# EAGLE design eggplant (EAGLE 7.7.0)
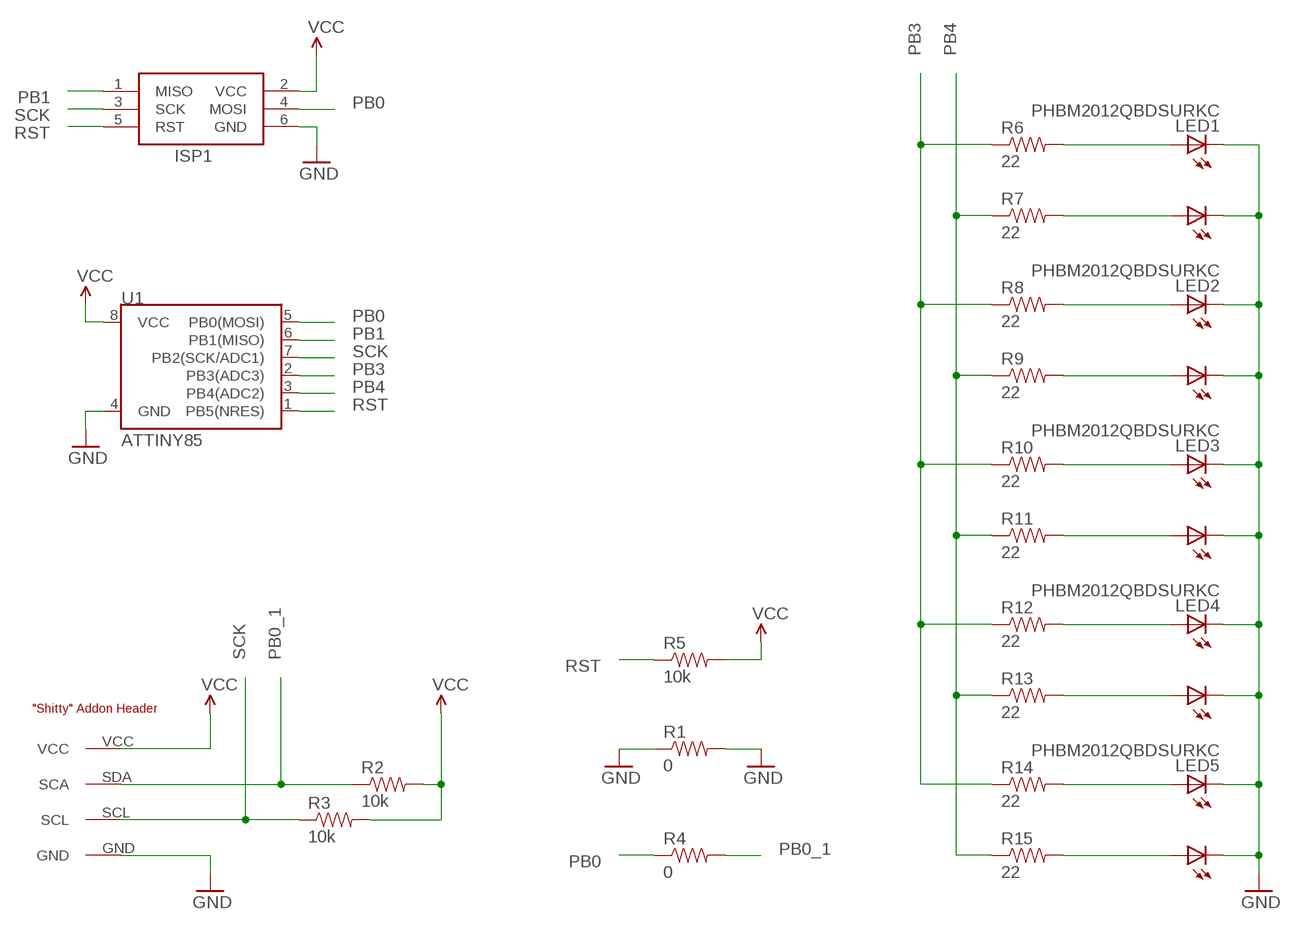
[diagram p0: schematic, sheet 1]

## Parts
ISP1  AVRISPPOGO  [AVRISP-POGO]
LED1  PHBM2012QBDSURKC  DUAL_LED0805  [0805-DUALLED]
LED2  PHBM2012QBDSURKC  DUAL_LED0805  [0805-DUALLED]
LED3  PHBM2012QBDSURKC  DUAL_LED0805  [0805-DUALLED]
LED4  PHBM2012QBDSURKC  DUAL_LED0805  [0805-DUALLED]
LED5  PHBM2012QBDSURKC  DUAL_LED0805  [0805-DUALLED]
R1  0  RESISTOR0805-RES  [0805]
R2  10k  RESISTOR0603-RES  [0603-RES]
R3  10k  RESISTOR0603-RES  [0603-RES]
R4  0  RESISTOR0805-RES  [0805]
R5  10k  RESISTOR0603-RES  [0603-RES]
R6  22  RESISTOR0603-RES  [0603-RES]
R7  22  RESISTOR0603-RES  [0603-RES]
R8  22  RESISTOR0603-RES  [0603-RES]
R9  22  RESISTOR0603-RES  [0603-RES]
R10  22  RESISTOR0603-RES  [0603-RES]
R11  22  RESISTOR0603-RES  [0603-RES]
R12  22  RESISTOR0603-RES  [0603-RES]
R13  22  RESISTOR0603-RES  [0603-RES]
R14  22  RESISTOR0603-RES  [0603-RES]
R15  22  RESISTOR0603-RES  [0603-RES]
U1  ATTINY85  ATTINY45  [SO08-EIAJ]
U$1  ADDONSC_ADDON_SMD  [SC_ADDON_SMD]

## Nets
GND: ISP1.6(GND) LED1.CB(C1) LED1.CR(C2) LED2.CB(C1) LED2.CR(C2) LED3.CB(C1) LED3.CR(C2) LED4.CB(C1) LED4.CR(C2) LED5.CB(C1) LED5.CR(C2) R1.1 R1.2 U1.4(GND) U$1.GND
N$1: LED1.AB(A1) R6.2
N$4: LED1.AR(A2) R7.2
N$5: LED2.AB(A1) R8.2
N$6: LED2.AR(A2) R9.2
N$7: LED3.AB(A1) R10.2
N$8: LED3.AR(A2) R11.2
N$9: LED4.AB(A1) R12.2
N$10: LED4.AR(A2) R13.2
N$11: LED5.AB(A1) R14.2
N$12: LED5.AR(A2) R15.2
PB0: ISP1.4(MOSI) R4.1 U1.5(PB0(MOSI))
PB0_1: R2.1 R4.2 U$1.SDA(SCA)
PB1: ISP1.1(MISO) U1.6(PB1(MISO))
PB3: R6.1 R8.1 R10.1 R12.1 R14.1 U1.2(PB3(ADC3))
PB4: R7.1 R9.1 R11.1 R13.1 R15.1 U1.3(PB4(ADC2))
RST: ISP1.5(RST) R5.1 U1.1(PB5(NRES))
SCK: ISP1.3(SCK) R3.1 U1.7(PB2(SCK/ADC1)) U$1.SCL
VCC: ISP1.2(VCC) R2.2 R3.2 R5.2 U1.8(VCC) U$1.VCC

## Library data of the parts
ISP1 = darknet_parts_library:AVRISP: AVR ISP HEADER Standard 6 pin header for AVR programming
LED1-LED5 = darknet_parts_library:DUAL_LED
R1-R15 = SYNShop:RESISTOR: Resistor Basic schematic elements and footprints for 0603, 1206, and PTH resistors.
U1 = SparkFun:ATTINY45: Atmel ATTiny45
U$1 = darknet_parts_library:ADDON

## Board
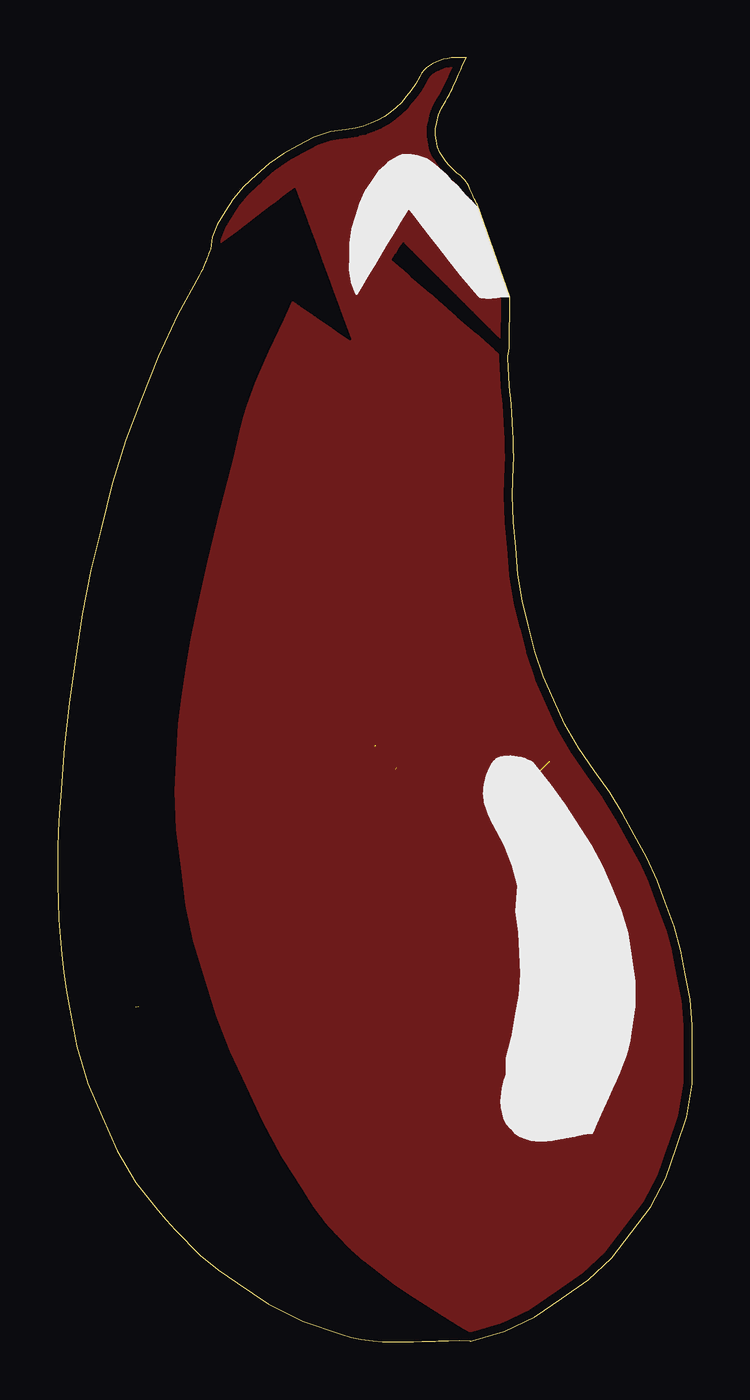
[diagram p1: board, top side]
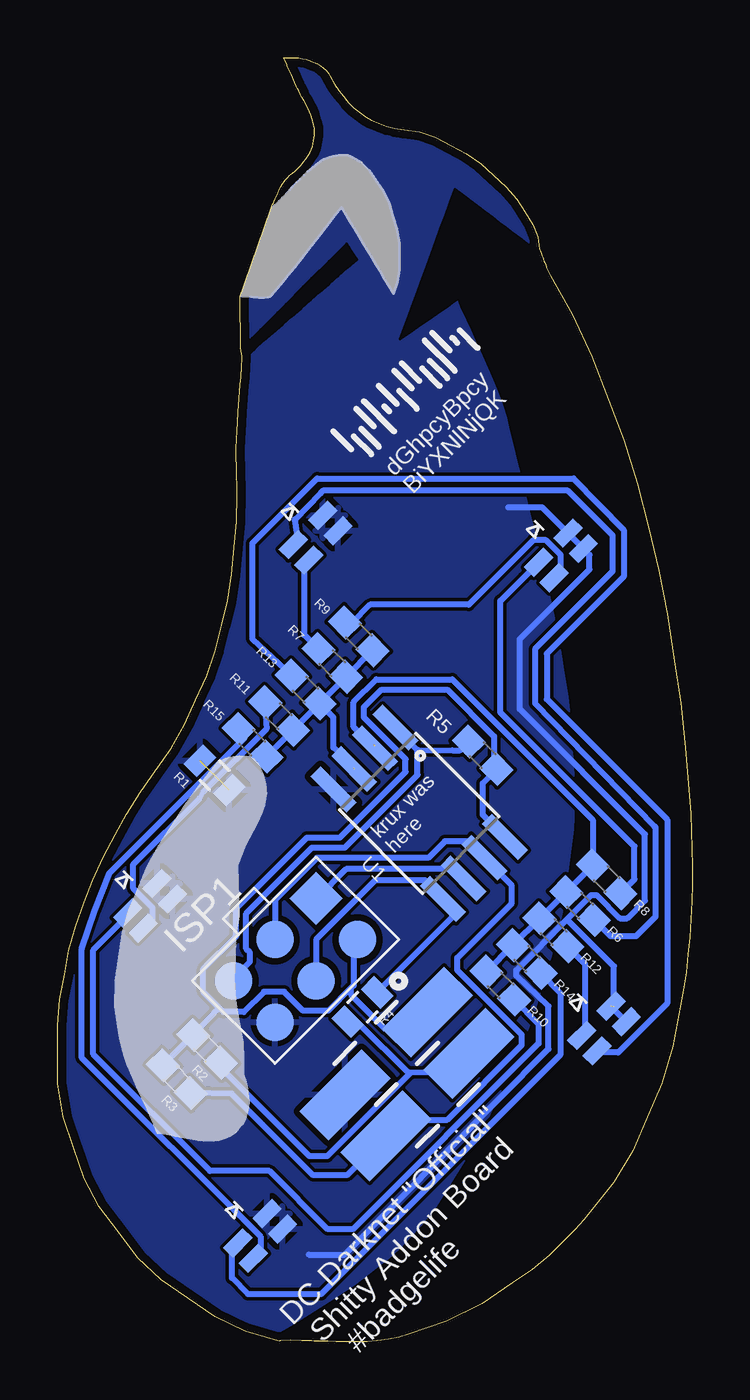
[diagram p2: board, bottom side, seen from below]

Size 27.62 x 55.85 mm. Coordinates in mm from the lower left corner, seen from the top.
Outline: 24.96,4.77 25.8,5.88 26.46,7.12 26.91,8.44 27.37,9.79 27.6,11.21 27.61,12.67 27.62,13.78 27.51,14.89 27.31,15.98 27.12,17.02 26.83,18.07 26.44,19.11 26.08,20.08 25.63,21.07 25.1,22.05 24.6,22.96 24.02,23.89 23.36,24.82 22.67,25.8 22.08,26.84 21.6,27.92 21.14,28.94 20.76,30.03 20.49,31.16 20.22,32.23 20.04,33.37 19.93,34.55 19.83,35.67 19.8,36.82 19.83,38.08 19.84,38.45 19.84,38.84 19.82,39.26 19.81,39.61 19.79,39.99 19.76,40.44 19.74,40.73 19.71,41.03 19.69,41.32 19.66,41.62 19.64,41.99 19.61,42.38 19.58,42.78 19.59,42.87 19.61,42.98 19.65,43.22 19.67,45.46 18.26,49.47 18.25,49.48 18.19,49.58 18.15,49.69 18.1,49.79 18.06,49.87 18.03,49.95 17.99,50.04 17.95,50.12 17.89,50.25 17.83,50.36 17.77,50.45 17.72,50.52 17.66,50.59 17.57,50.68 17.54,50.7 17.51,50.73 17.39,50.83 17.27,50.94 17.02,51.18 16.91,51.32 16.81,51.46 16.64,51.71 16.53,51.96 16.48,52.22 16.43,52.49 16.44,52.76 16.51,53.05 16.58,53.34 16.71,53.65 16.9,53.98 16.97,54.1 17.04,54.23 17.11,54.38 17.17,54.5 17.23,54.63 17.3,54.79 17.35,54.89 17.4,54.99 17.44,55.1 17.48,55.19 17.54,55.32 17.6,55.46 17.66,55.6 17.78,55.85 17.5,55.85 17.31,55.85 17.13,55.84 16.96,55.8 16.78,55.77 16.62,55.72 16.47,55.65 16.31,55.59 16.18,55.5 16.06,55.4 15.93,55.3 15.83,55.18 15.76,55.05 15.57,54.7 15.37,54.41 15.17,54.16 14.96,53.89 14.73,53.67 14.48,53.48 14.23,53.29 13.95,53.13 13.63,53 13.31,52.88 12.96,52.78 12.55,52.72 11.87,52.62 11.17,52.38 10.47,52.02 9.83,51.68 9.2,51.24 8.64,50.74 8.1,50.25 7.64,49.7 7.29,49.15 6.94,48.58 6.72,48.03 6.66,47.52 6.61,47.42 6.58,47.32 6.54,47.24 6.51,47.15 6.48,47.08 6.45,47.01 6.43,46.93 6.38,46.82 6.34,46.72 6.3,46.64 6.26,46.54 6.21,46.45 6.17,46.36 5.22,44.66 4.37,42.85 3.65,40.97 2.98,39.21 2.39,37.32 1.9,35.37 1.45,33.55 1.08,31.66 0.78,29.62 0.51,27.78 0.3,25.86 0.14,23.75 0.08,22.98 0.04,22.21 0.02,21.46 0,20.68 0,19.9 0.03,19.15 0.06,18.37 0.11,17.59 0.19,16.85 0.27,16.07 0.38,15.31 0.52,14.58 0.84,12.86 1.32,11.25 1.95,9.8 2.59,8.31 3.41,6.95 4.37,5.76 4.73,5.31 5.11,4.88 6.21,3.78 6.99,3.14 7.82,2.57 9.16,1.65 10.69,0.9 12.36,0.34 12.76,0.21 13.21,0.11 13.72,0.06 14.13,0.02 14.58,0 15.14,0.01 15.49,0.01 15.85,0.02 16.2,0.03 16.32,0.04 16.45,0.04 16.57,0.05 17.01,0.06 17.47,0.07 17.93,0.05 17.96,0.04 18.04,0.06 19.45,0.47 20.76,1.09 21.94,1.9 23.1,2.7 24.12,3.66 24.96,4.77
Copper layers (1*16): Top 0.035559375mm / dielectric 1.6mm / Bottom 0.035559375mm
Design rules "oshpark-2layer": minimum track width 6mil, minimum drill 10mil, track to track 6mil, track to pad 6mil, pad to pad 6mil, via to via 6mil, smd to smd 6mil, copper to edge 15mil, drill to drill 6mil, minimum pad ring 5mil, minimum via ring 5mil, stop-mask expansion 2.5mil, vias tented up to drill 0mil, thermal gap 10mil
tRestrict: area 0.2,0.2 to 18,50.1; area 14.6,42.8 to 19.5,47.8
bRestrict: area 0.2,0.2 to 18,50.1; area 14.6,42.8 to 19.5,47.8

### Footprints (pad centres in the part's own frame; a part is rotated, then mirrored left to right if it is on the bottom)
AVRISP-POGO = smd 1.626 x 1.626: 1 -1.27,2.54; 2 1.27,2.54; 3 -1.27,0; 4 1.27,0; 5 -1.27,-2.54; 6 1.27,-2.54
0805-DUALLED = smd 1.2 x 0.6: AB -0.9,0.475; AR -0.9,-0.475; CB 0.9,0.475; CR 0.9,-0.475
0805 = smd 0.8 x 1.2: 1 -0.9,0; 2 0.9,0
0603-RES = smd 1.1 x 1: 1 -0.85,0; 2 0.85,0
SO08-EIAJ = smd 0.61 x 2.21: 1 -1.905,-3.378; 2 -0.635,-3.378; 3 0.635,-3.378; 4 1.905,-3.378; 5 1.905,3.353; 6 0.635,3.353; 7 -0.635,3.353; 8 -1.905,3.353
SC_ADDON_SMD = smd 3.81 x 1.778 bottom: GND 2.54,1.27; SCL 2.54,-1.27; SDA -2.54,-1.27; VCC -2.54,1.27

### Placement (x,y rotation side)
ISP1  17.26,16.6 315 bottom
LED1  16.38,34.97 45 bottom
LED2  5.71,34.2 45 bottom
LED3  23.59,18.97 45 bottom
LED4  3.84,13.63 45 bottom
LED5  18.8,4.61 45 bottom
R1  20.78,24.63 315 bottom
R2  21.11,12.75 135 bottom
R3  22.43,11.43 135 bottom
R4  14.35,14.56 225 bottom
R5  9.12,25.51 315 bottom
R6  4.88,18.97 315 bottom
R7  15.67,29.53 135 bottom
R8  3.73,20.12 315 bottom
R9  14.51,30.68 135 bottom
R10  8.35,15.5 315 bottom
R11  17.98,27.22 135 bottom
R12  6.04,17.81 315 bottom
R13  16.82,28.37 135 bottom
R14  7.2,16.66 315 bottom
R15  19.13,26.06 135 bottom
U1  11.87,22.98 225 bottom
U$1  12.42,11.65 315 top

### Tracks (layer width: path | path; a pad name or v marks a point on that pad's centre or on a via)
GND  (2 unrouted)
  Bottom 0.152: LED5.CB 18.47,5.58
  Bottom 0.254: LED2.CR LED2.CB 6.52,36.29 8.02,36.29 | LED4.CR LED4.CB | 4.71,34.48 LED2.CR | 3.37,14.53 3.41,14.57 3.41,16.34 5.46,18.37 | 5.46,18.37 4.4,19.43 4.16,19.43 3.15,18.42 2.84,18.42 2.06,19.2 2.06,22.08 7.51,27.52 7.51,30.56 4.47,33.59 4.47,34.22 LED2.CR | 16.69,3.8 15.13,3.8 6.26,12.74 6.26,14.61 7.66,15.93 7.66,16.17 5.46,18.37
  pour Top: 19.45,42.83 19.48,42.44 19.5,42.05 19.54,41.66 19.57,41.26 19.6,40.87 19.66,40.09 19.68,39.7 19.7,39.31 19.71,38.92 19.71,38.53 19.7,38.14 19.67,36.93 19.7,35.75 19.8,34.59 19.91,33.43 20.09,32.29 20.36,31.17 20.64,30.05 21.01,28.96 21.48,27.9 21.96,26.83 22.55,25.79 23.27,24.77 23.9,23.88 24.48,22.96 25.51,21.07 25.96,20.1 26.33,19.1 26.7,18.09 26.99,17.07 27.19,16 27.38,14.94 27.49,13.85 27.48,12.72 27.48,11.26 27.23,9.86 26.79,8.55 26.34,7.24 25.69,6.02 24.87,4.93 24.04,3.85 23.04,2.89 21.89,2.1 20.74,1.32 19.45,0.7 18.04,0.29 17.33,0.71 16.63,1.13 15.94,1.57 15.26,2.01 14.59,2.47 13.31,3.47 12.71,4.01 12.14,4.61 11.58,5.2 11.07,5.86 10.61,6.59 9.69,8.06 8.87,9.56 8.15,11.08 7.44,12.61 6.83,14.17 5.87,17.36 5.51,18.98 5.3,20.63 5.09,22.28 5.03,23.96 5.13,25.68 5.19,26.86 5.33,28.05 5.52,29.23 5.7,30.41 5.94,31.59 6.2,32.76 6.46,33.94 6.75,35.11 7.04,36.28 7.33,37.46 7.63,38.62 7.91,39.79 8.03,40.28 8.18,40.76 8.36,41.24 8.54,41.72 8.73,42.18 9.15,43.11 9.36,43.56 9.58,44.02 9.79,44.47 9.99,44.91 10.18,45.36 10.43,45.19 10.66,45.02 10.89,44.87 11.11,44.71 11.33,44.57 11.74,44.28 11.94,44.14 12.33,43.87 12.53,43.74 12.72,43.61 12.88,43.9 13.03,44.18 13.19,44.47 13.34,44.76 13.5,45.05 13.66,45.33 13.81,45.62 13.97,45.91 14.12,46.2 14.28,46.48 14.44,46.77 14.59,47.06 15,46.71 15.81,46 16.21,45.65 16.62,45.3 17.02,44.94 17.43,44.59 17.83,44.24 18.24,43.89 18.64,43.53 19.05,43.18
  pour Bottom: 19.45,42.83 19.48,42.44 19.5,42.05 19.57,41.26 19.6,40.87 19.66,40.09 19.68,39.7 19.71,38.92 19.71,38.53 19.7,38.14 19.67,36.93 19.7,35.75 19.8,34.59 19.91,33.43 20.09,32.29 20.36,31.17 20.64,30.05 21.01,28.96 21.96,26.83 22.55,25.79 23.27,24.77 23.9,23.88 24.48,22.96 25.51,21.07 25.96,20.1 26.33,19.1 26.7,18.09 26.99,17.07 27.38,14.94 27.49,13.85 27.48,12.72 27.48,11.26 27.23,9.86 26.79,8.55 26.34,7.24 25.69,6.02 24.87,4.93 24.04,3.85 23.04,2.89 21.89,2.1 20.74,1.32 19.45,0.7 18.04,0.29 17.33,0.71 16.63,1.13 15.26,2.01 14.59,2.47 13.31,3.47 12.71,4.01 12.14,4.61 11.58,5.2 11.07,5.86 10.61,6.59 9.69,8.06 8.87,9.56 7.44,12.61 6.83,14.17 5.87,17.36 5.51,18.98 5.3,20.63 5.09,22.28 5.03,23.96 5.13,25.68 5.19,26.86 5.33,28.05 5.52,29.23 5.7,30.41 5.94,31.59 6.2,32.76 6.46,33.94 6.75,35.11 7.04,36.28 7.33,37.46 7.63,38.62 7.91,39.79 8.03,40.28 8.18,40.76 8.36,41.24 8.54,41.72 8.73,42.18 9.15,43.11 9.36,43.56 9.58,44.02 9.79,44.47 9.99,44.91 10.18,45.36 10.43,45.19 10.66,45.02 11.11,44.71 11.33,44.57 11.74,44.28 11.94,44.14 12.33,43.87 12.53,43.74 12.72,43.61 12.88,43.9 13.03,44.18 13.5,45.05 13.66,45.33 14.12,46.2 14.28,46.48 14.59,47.06 15,46.71 15.81,46 16.21,45.65 16.62,45.3 17.02,44.94 17.43,44.59 17.83,44.24 18.24,43.89 18.64,43.53 19.05,43.18
N$1
  Bottom 0.254: LED1.AB 17.14,34.92 17.29,35.77 16.17,36.91 16.07,37.01 5.41,37.01 3.46,35.07 3.46,33.51 6.84,30.13 6.84,27.78 1.66,22.44 1.59,22.37 1.59,18.5 2.45,17.64 3.56,17.64 R6.2
N$2
  pour Top: 12.72,43.61 12.53,44.13 12.33,44.66 12.14,45.19 11.94,45.72 11.75,46.25 11.55,46.79 11.35,47.33 11.15,47.87 10.95,48.43 10.74,48.98 10.54,49.55 10.32,50.13 10.08,49.95 9.82,49.75 9.55,49.54 9.27,49.34 8.99,49.12 8.7,48.9 8.41,48.68 8.11,48.45 7.8,48.22 7.5,47.99 7.19,47.76 6.88,47.53 6.95,48.03 7.16,48.57 7.83,49.64 8.29,50.17 8.82,50.66 9.35,51.14 9.96,51.57 10.61,51.91 11.25,52.25 11.94,52.49 12.63,52.59 13.05,52.66 13.42,52.76 13.75,52.89 14.09,53.02 14.38,53.19 14.65,53.39 14.91,53.59 15.15,53.83 15.37,54.1 15.58,54.37 15.78,54.67 15.97,55.01 16.03,55.13 16.12,55.23 16.23,55.32 16.33,55.41 16.46,55.48 16.59,55.54 16.73,55.6 16.88,55.65 17.04,55.68 17.21,55.71 17.38,55.72 17.55,55.72 17.49,55.59 17.43,55.45 17.37,55.32 17.31,55.18 17.25,55.05 17.13,54.78 17.07,54.64 16.94,54.38 16.87,54.25 16.8,54.12 16.59,53.78 16.46,53.46 16.38,53.14 16.31,52.83 16.3,52.53 16.35,52.24 16.41,51.96 16.53,51.68 16.71,51.41 16.89,51.15 17.14,50.89 17.45,50.64 17.54,50.57 17.61,50.49 17.67,50.4 17.73,50.3 17.79,50.2 17.84,50.09 17.89,49.99 17.94,49.88 17.99,49.77 18.04,49.66 18.09,49.55 18.14,49.45 17.98,49.6 17.83,49.77 17.52,50.09 17.38,50.27 17.23,50.43 17.06,50.57 16.9,50.73 16.73,50.88 16.57,51.03 16.4,51.17 16.22,51.3 16.13,51.36 16.02,51.42 15.9,51.47 15.78,51.52 15.64,51.56 15.51,51.58 15.37,51.6 15.24,51.61 15.12,51.6 15,51.6 14.89,51.57 14.8,51.52 14.4,51.29 14.03,50.93 13.73,50.48 13.43,50.03 13.18,49.5 13.01,48.94 12.84,48.38 12.75,47.79 12.74,47.21 12.73,46.64 12.82,46.08 13,45.59 13.19,45.91 13.38,46.22 13.57,46.53 13.76,46.85 13.94,47.16 14.32,47.78 14.5,48.09 14.69,48.4 14.88,48.71 15.07,49.03 15.27,49.35 15.55,48.99 15.81,48.65 16.33,47.97 16.58,47.65 17.08,47.01 17.33,46.7 17.58,46.39 17.82,46.09 18.07,45.8 18.33,45.51 18.38,45.45 18.45,45.43 18.63,45.4 18.73,45.41 18.85,45.42 18.96,45.42 19.08,45.44 19.2,45.45 19.32,45.47 19.44,45.48 19.54,45.48 19.54,45.3 19.54,45.11 19.53,44.93 19.53,44.75 19.53,44.57 19.53,44.38 19.53,44.2 19.53,44.02 19.52,43.84 19.52,43.65 19.52,43.47 19.52,43.29 19.15,43.66 18.78,44.03 18.04,44.77 17.67,45.14 16.93,45.88 16.56,46.25 15.8,47 15.04,47.76 15.03,47.74 15,47.7 14.97,47.65 14.94,47.6 14.9,47.55 14.86,47.48 14.82,47.42 14.78,47.35 14.73,47.28 14.69,47.21 14.64,47.13 14.59,47.06 14.44,46.77 14.28,46.48 13.66,45.33 13.5,45.05 13.03,44.18 12.88,43.9
N$3
  pour Bottom: 12.72,43.61 12.53,44.13 12.33,44.66 12.14,45.19 11.94,45.72 11.75,46.25 11.55,46.79 11.35,47.33 11.15,47.87 10.95,48.43 10.74,48.98 10.54,49.55 10.32,50.13 10.08,49.95 9.82,49.75 9.55,49.54 9.27,49.34 8.99,49.12 8.7,48.9 8.41,48.68 8.11,48.45 7.8,48.22 7.5,47.99 7.19,47.76 6.88,47.53 6.95,48.03 7.16,48.57 7.83,49.64 8.29,50.17 8.82,50.66 9.35,51.14 9.96,51.57 10.61,51.91 11.25,52.25 11.94,52.49 12.63,52.59 13.05,52.66 13.42,52.76 13.75,52.89 14.09,53.02 14.38,53.19 14.65,53.39 14.91,53.59 15.15,53.83 15.37,54.1 15.58,54.37 15.78,54.67 15.97,55.01 16.03,55.13 16.12,55.23 16.23,55.32 16.33,55.41 16.46,55.48 16.59,55.54 16.73,55.6 16.88,55.65 17.04,55.68 17.21,55.71 17.38,55.72 17.55,55.72 17.49,55.59 17.43,55.45 17.37,55.32 17.31,55.18 17.25,55.05 17.13,54.78 17.07,54.64 16.94,54.38 16.87,54.25 16.8,54.12 16.59,53.78 16.46,53.46 16.38,53.14 16.31,52.83 16.3,52.53 16.35,52.24 16.41,51.96 16.53,51.68 16.71,51.41 16.89,51.15 17.14,50.89 17.45,50.64 17.54,50.57 17.61,50.49 17.67,50.4 17.73,50.3 17.79,50.2 17.84,50.09 17.89,49.99 17.94,49.88 17.99,49.77 18.04,49.66 18.09,49.55 18.14,49.45 17.98,49.6 17.83,49.77 17.52,50.09 17.38,50.27 17.23,50.43 17.06,50.57 16.9,50.73 16.73,50.88 16.57,51.03 16.4,51.17 16.22,51.3 16.13,51.36 16.02,51.42 15.9,51.47 15.78,51.52 15.64,51.56 15.51,51.58 15.37,51.6 15.24,51.61 15.12,51.6 15,51.6 14.89,51.57 14.8,51.52 14.4,51.29 14.03,50.93 13.73,50.48 13.43,50.03 13.18,49.5 13.01,48.94 12.84,48.38 12.75,47.79 12.74,47.21 12.73,46.64 12.82,46.08 13,45.59 13.19,45.91 13.38,46.22 13.57,46.53 13.76,46.85 13.94,47.16 14.32,47.78 14.5,48.09 14.69,48.4 14.88,48.71 15.07,49.03 15.27,49.35 15.55,48.99 15.81,48.65 16.33,47.97 16.58,47.65 17.08,47.01 17.33,46.7 17.58,46.39 17.82,46.09 18.07,45.8 18.33,45.51 18.38,45.45 18.45,45.43 18.63,45.4 18.73,45.41 18.85,45.42 18.96,45.42 19.08,45.44 19.2,45.45 19.32,45.47 19.44,45.48 19.54,45.48 19.54,45.3 19.54,45.11 19.53,44.93 19.53,44.75 19.53,44.57 19.53,44.38 19.53,44.2 19.53,44.02 19.52,43.84 19.52,43.65 19.52,43.47 19.52,43.29 19.15,43.66 18.78,44.03 18.04,44.77 17.67,45.14 16.93,45.88 16.56,46.25 15.8,47 15.04,47.76 15.03,47.74 15,47.7 14.97,47.65 14.94,47.6 14.9,47.55 14.86,47.48 14.82,47.42 14.78,47.35 14.73,47.28 14.69,47.21 14.64,47.13 14.59,47.06 14.44,46.77 14.28,46.48 13.66,45.33 13.5,45.05 13.03,44.18 12.88,43.9
N$4
  Bottom 0.254: R7.2 16.88,30.74 16.88,33.56 16.82,33.81 LED1.AR
N$5
  Bottom 0.254: R8.2 3.33,19.32 3.32,19.32 2.52,20.12 2.52,21.55 8.35,27.38 8.35,32.22 7.34,33.23 LED2.AB
N$6
  Bottom 0.254: LED2.AR 5.73,33.48 5.73,34.23 6.37,34.87 6.92,34.87 9.73,32.06 14.02,32.06 14.82,31.25 R9.2
N$7
  Bottom 0.254: R10.2 6.69,13.84 6.69,12.98 14.77,4.9 15.86,4.9 18.4,7.44 20.99,7.44 26.06,12.52 26.06,17.04 24.69,18.41 LED3.AB
N$8
  Bottom 0.229: 18.53,26.67 21.28,23.92 21.44,23.64
  Bottom 0.254: R11.2 18.58,27.53 18.53,26.67 | 21.44,23.64 24.31,20.77 24.31,19.71 23.49,18.89 23.49,18.24 LED3.AR
N$9
  Bottom 0.254: LED4.AB 4.73,13.38 4.66,13.51 4.66,16.43 R12.2
N$10
  Bottom 0.254: R13.2 19.13,30.57 19.13,34.74 16.32,37.55 5.17,37.55 2.99,35.31 2.99,33.28 6.33,29.94 6.33,27.95 1.1,22.72 1.1,14.72 3.23,12.59 4.07,12.59 LED4.AR
N$11
  Bottom 0.254: R14.2 5.75,15.18 5.75,12.48 16.15,2.08 19.33,2.08 20.03,2.79 20.03,4.05 LED5.AB
N$12
  Bottom 0.229: 21.72,24.03 19.48,26.26 R15.2
  Bottom 0.254: 21.72,24.03 25.35,20.4 26.01,18.75 26.56,17.09 26.56,12.35 18.79,4.59 18.79,3.95 LED5.AR
PB0
  Bottom 0.254: ISP1.4 16.36,17.5 13.8,20.07 11.6,20.07 10.88,19.35 10.88,19.24 10.77,19.13 10.77,19.19 U1.5 10.79,19.26 10.22,18.69 R4.1
PB0_1
  Bottom 0.254: U$1.SDA 10.52,11.76 12.26,11.7 12.31,11.65 | 12.31,11.65 15.89,8.07 16.66,8.07 20.47,11.89 R2.1 | 12.31,11.65 14.59,13.93 R4.2
PB1
  Bottom 0.254: U1.6 10.35,20.56 15.06,20.56 16.33,19.29 ISP1.1 | 9.88,20.11 U1.6 | 9.93,20.16 U1.6
PB3  (1 unrouted)
  Bottom 0.254: 13.85,25.95 13.91,25.9 | 13.81,25.91 U1.2 14.73,26.74 14.73,27.82 13.74,28.81 10.44,28.81 4.33,22.7 R8.1 R6.1 R12.1 R14.1 R10.1
PB4  (1 unrouted)
  Bottom 0.254: 14.68,25.02 14.73,24.96 15.61,25.84 15.61,27.16 R13.1 | 14.71,24.94 U1.3 | R9.1 R7.1 R13.1 | R13.1 R11.1 R15.1
RST
  Bottom 0.254: U1.1 11.95,25.75 | 11.95,25.75 10.44,25.73 10.1,25.73 R5.1 | ISP1.5 20.01,15.76 19.24,16.53 19.24,16.93 19.41,17.09 19.41,18.63 16.55,21.5 15.12,21.5 11.95,24.66 11.95,25.75
SCK
  Bottom 0.254: ISP1.3 18.16,19.22 16.33,21.06 11.49,21.06 10.77,21.77 9.76,21.77 U1.7 9.05,21.04 7.86,19.85 7.86,19.08 10.22,16.71 10.22,16.16 7.42,13.35 7.42,12.91 10.66,9.67 12.6,9.67 U$1.SCL 15.02,7.25 16.49,7.25 20.03,10.79 R3.1
VCC
  Bottom 0.254: U1.8 9.12,22.92 9.12,24.3 R5.2 8.88,24.87 8.63,25.13 8.63,26.34 10.66,28.37 13.52,28.37 14.29,27.6 14.29,27.16 12.48,25.35 12.48,24.8 15.34,21.94 16.77,21.94 19.85,18.86 19.85,17.64 21.28,16.21 21.28,15.22 20.56,14.51 | U$1.VCC 11.3,14.23 13.34,13.6 14.84,15.1 14.84,15.39 | ISP1.2 14.73,17.33 14.73,15.5 14.84,15.39 | 14.84,15.39 15.83,14.4 16.93,14.4 17.76,15.22 18.64,15.22 19.52,14.34 20.4,14.34 20.56,14.51 | R3.2 R2.2 20.62,14.51 20.56,14.51

### Text on the board
bNames: dGhpcyBpcy / BiYXNlNjQK | krux was / here | DC Darknet "Official" / Shitty Addon Board / #badgelife